# EasyEDA Pro project DAGS-S.eprj

# Schematic Schematic1
Board Name: Board1; Create Date: 2024-12-27; Page Name: P1; Project Name: DAGS-S; Schematic Name: Schematic1; Update Date: 2024-12-27; Company: poyu39; Page Size: A4; Version: V1.0
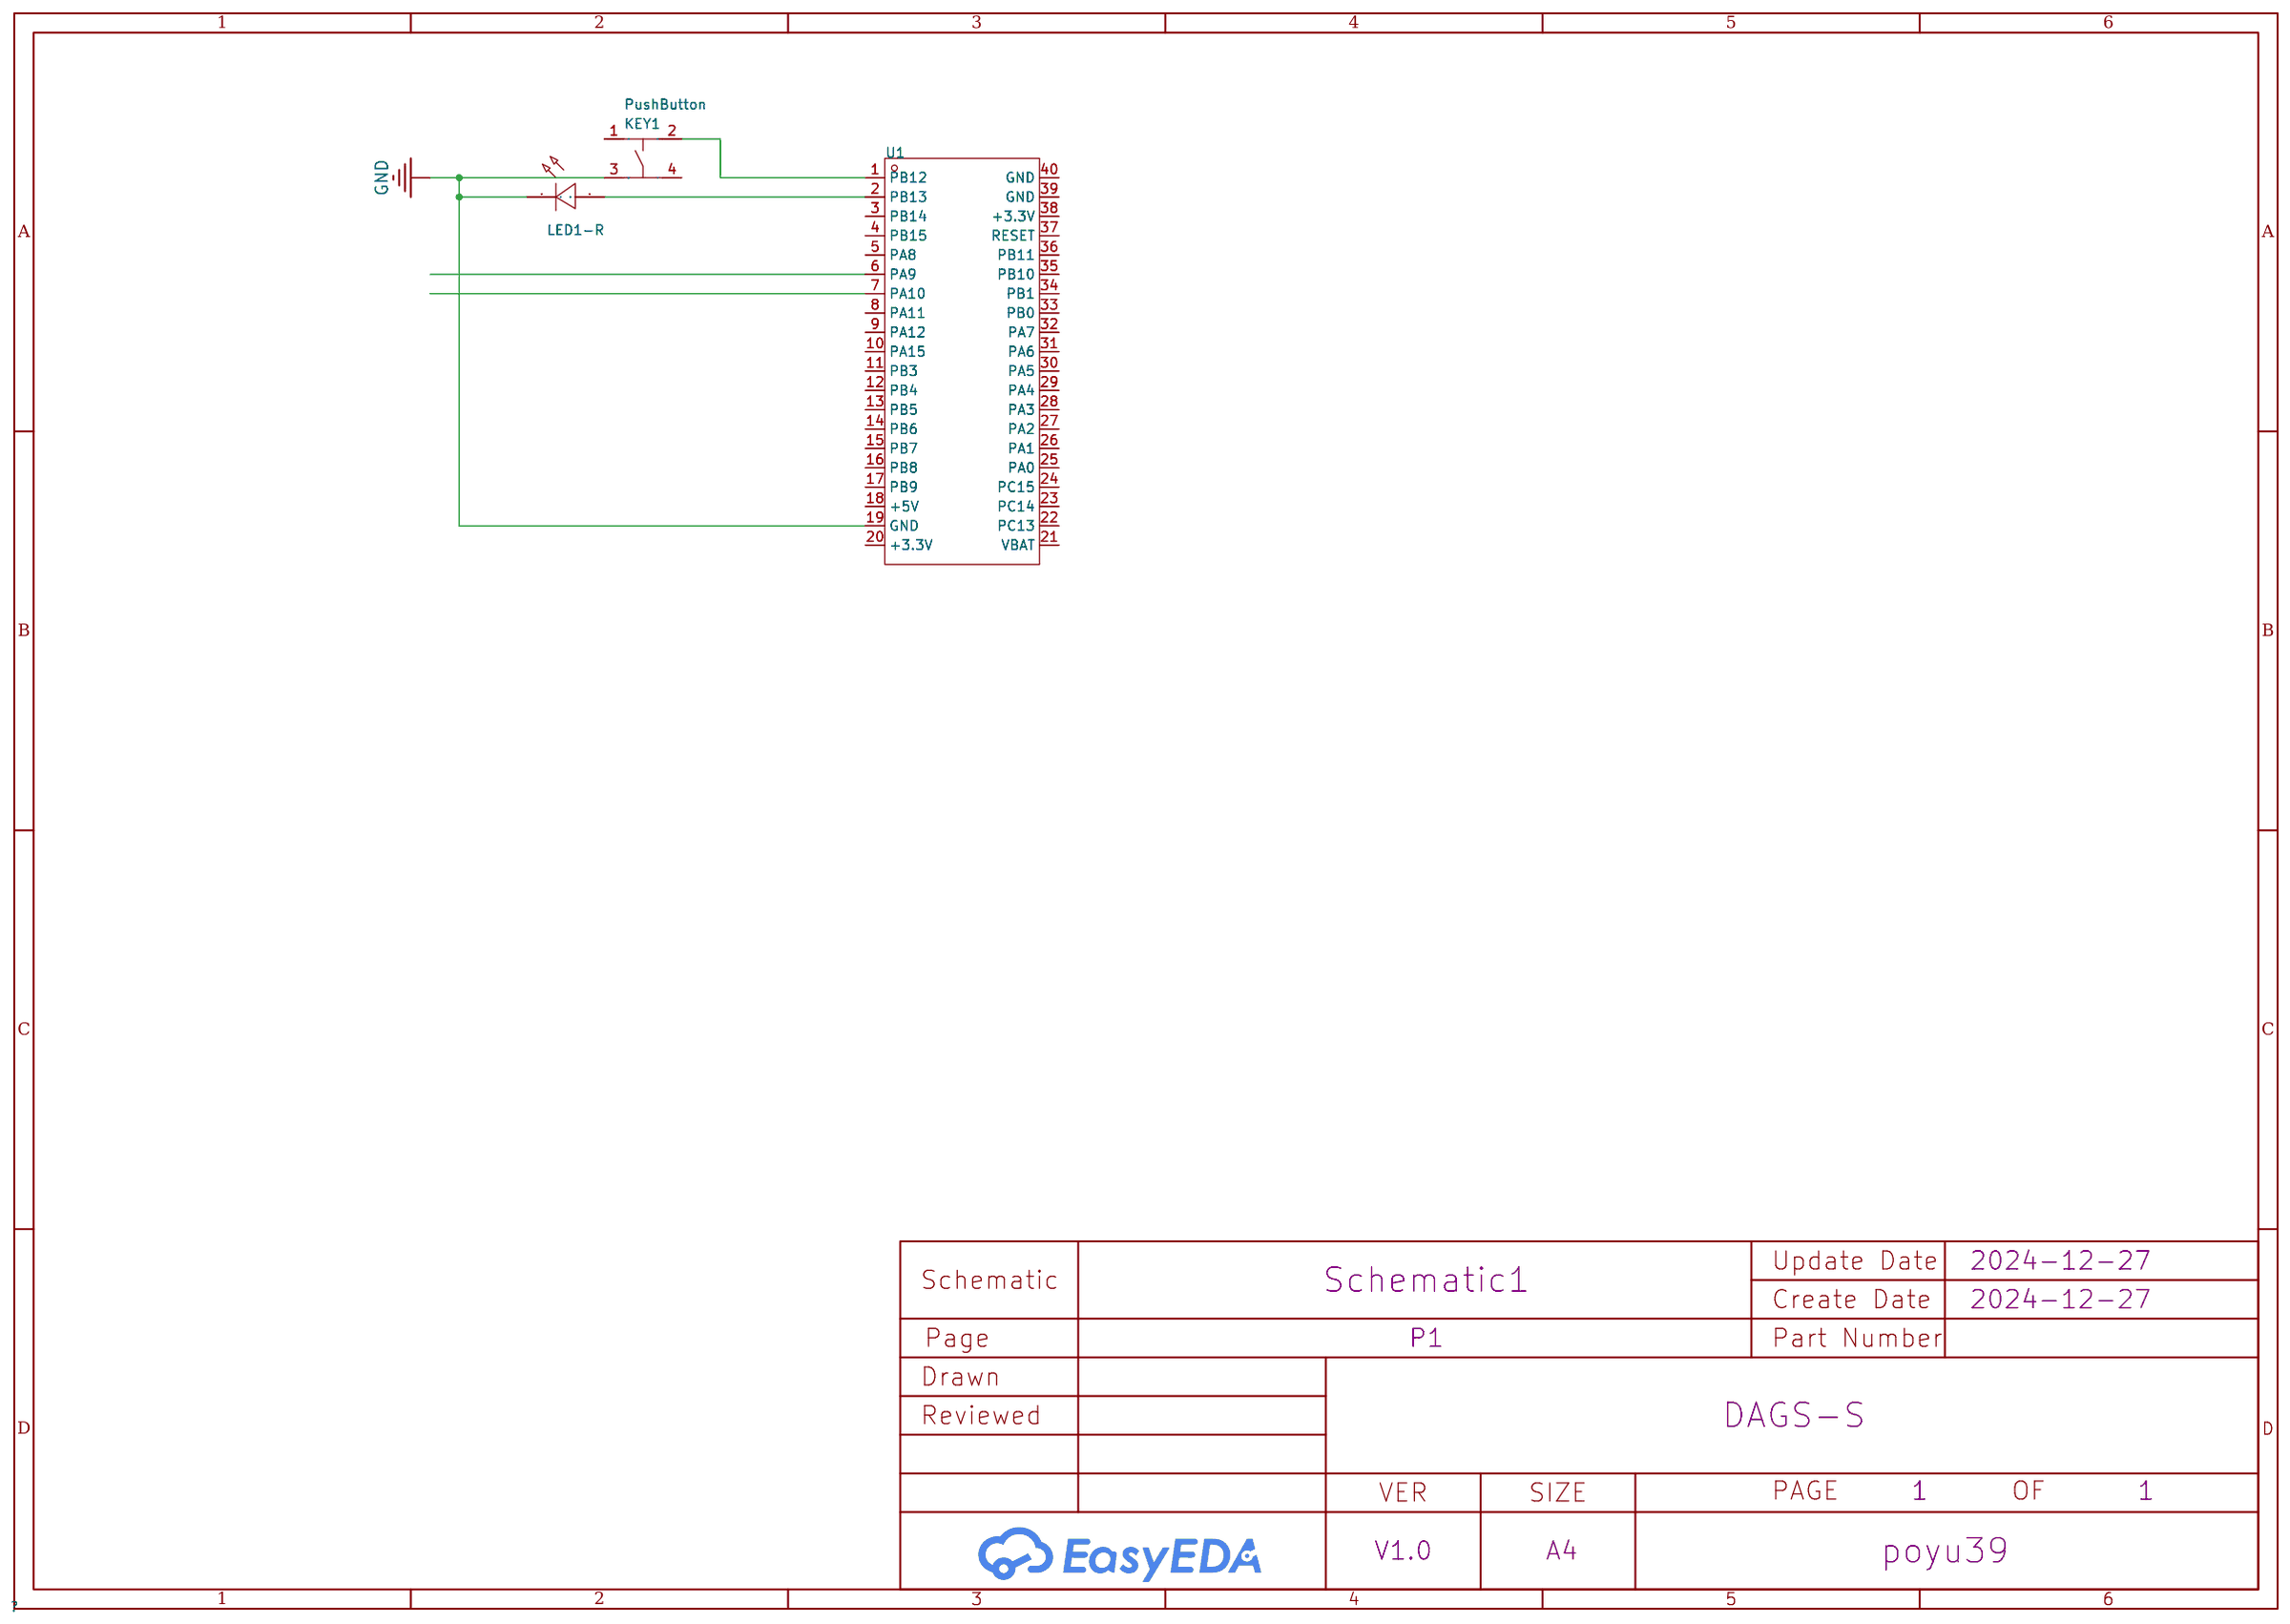
[diagram p0: schematic sheet]

## Parts
KEY1  PushButton  [KEY-SMD_4P-L6.6-W6.4-P4.00-LS9.4]
LED1-R  -  [LED-TH_BD3.0-P2.54-FD]
U1  LCKFB-DKX-STM32F103C8T6  [CONN-TH_L53.3-W22.9_STM32F103C8T6-CARD]

## Library data of the parts
KEY1 = 6*6*3.5轻触开关250gf四脚: Supplier Part: C9900004567; Supplier Footprint: SW-SMD-4P; JLCPCB Part Class: Extended Part; Supplier: LCSC
LED1-R = LED_TH-R_3mm: Supplier Footprint: Through
U1 = LCKFB-DKX-STM32F103C8T6: LCSC Part Name: 立创·地阔星-STM32F103C8T6开发板; Supplier Part: C22396880; Manufacturer: 立创开发板; JLCPCB Part Class: Extended Part; Datasheet: https://atta.szlcsc.com/upload/public/pdf/source/20240801/7EEF69F7480DF7C6DA98696664D658D4.pdf; Supplier: LCSC

## Nets
GND: KEY1.3 LED1-R.2(A) U1.19(GND)
Net-(KEY1-2): KEY1.2 U1.1(PB12)
Net-(LED1-R-1): LED1-R.1(C) U1.2(PB13)

Not connected (* = marked no-connect by the designer): KEY1 1 4; U1 3(PB14) 4(PB15) 5(PA8) 6(PA9) 7(PA10) 8(PA11) 9(PA12) 10(PA15) 11(PB3) 12(PB4) 13(PB5) 14(PB6) 15(PB7) 16(PB8) 17(PB9) 18(+5V) 20(+3.3V) 21(VBAT) 22(PC13) 23(PC14) 24(PC15) 25(PA0) 26(PA1) 27(PA2) 28(PA3) 29(PA4) 30(PA5) 31(PA6) 32(PA7) 33(PB0) 34(PB1) 35(PB10) 36(PB11) 37(RESET) 38(+3.3V) 39(GND) 40(GND)
